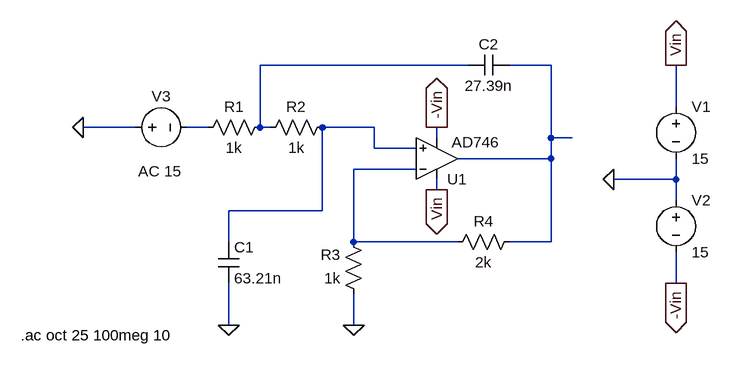
[diagram p0: schematic полосовой салена.asc]
полосовой салена.asc, the LTspice schematic file:
Version 4
SHEET 1 880 680
WIRE 256 64 -64 64
WIRE 384 64 320 64
WIRE 576 128 576 64
WIRE -256 160 -336 160
WIRE -144 160 -176 160
WIRE -64 160 -64 64
WIRE -48 160 -64 160
WIRE 112 160 32 160
WIRE 208 176 208 160
WIRE 384 176 384 64
WIRE 416 176 384 176
WIRE 112 192 112 160
WIRE 176 192 112 192
WIRE 384 208 384 176
WIRE 384 208 240 208
WIRE 176 224 80 224
WIRE 576 240 576 208
WIRE 576 240 480 240
WIRE 208 256 208 240
WIRE 576 272 576 240
WIRE 32 288 32 160
WIRE 32 288 -112 288
WIRE -112 336 -112 288
WIRE 80 336 80 224
WIRE 240 336 80 336
WIRE 384 336 384 208
WIRE 384 336 320 336
WIRE 576 400 576 352
WIRE -112 464 -112 400
WIRE 80 464 80 416
FLAG 480 240 0
FLAG 576 64 Vin
IOPIN 576 64 Out
FLAG 576 400 -Vin
IOPIN 576 400 Out
FLAG 208 256 Vin
IOPIN 208 256 Out
FLAG 208 160 -Vin
IOPIN 208 160 Out
FLAG -336 160 0
FLAG -112 464 0
FLAG 80 464 0
SYMBOL Opamps\\AD746 208 272 M180
WINDOW 3 23 89 Left 2
SYMATTR InstName U1
SYMBOL voltage 576 112 R0
SYMATTR InstName V1
SYMATTR Value 15
SYMBOL voltage 576 256 R0
SYMATTR InstName V2
SYMATTR Value 15
SYMBOL voltage -272 160 R270
WINDOW 0 32 56 VTop 2
WINDOW 3 -144 56 VBottom 2
WINDOW 123 -52 54 VBottom 2
WINDOW 39 0 0 Left 0
SYMATTR InstName V3
SYMATTR Value ""
SYMATTR Value2 AC 15
SYMBOL cap 320 48 R90
WINDOW 0 0 32 VBottom 2
WINDOW 3 32 32 VTop 2
SYMATTR InstName C2
SYMATTR Value 27.39n
SYMBOL res -48 144 R90
WINDOW 0 0 56 VBottom 2
WINDOW 3 32 56 VTop 2
SYMATTR InstName R1
SYMATTR Value 1k
SYMBOL res 48 144 R90
WINDOW 0 0 56 VBottom 2
WINDOW 3 32 56 VTop 2
SYMATTR InstName R2
SYMATTR Value 1k
SYMBOL res 96 432 R180
WINDOW 0 36 76 Left 2
WINDOW 3 36 40 Left 2
SYMATTR InstName R3
SYMATTR Value 1k
SYMBOL res 224 352 R270
WINDOW 0 32 56 VTop 2
WINDOW 3 0 56 VBottom 2
SYMATTR InstName R4
SYMATTR Value 2k
SYMBOL cap -128 336 R0
SYMATTR InstName C1
SYMATTR Value 63.21n
TEXT -432 480 Left 2 !.ac oct 25 100meg 10

The netlist it stands for:
* полосовой салена.asc
XU1 N004 N005 Vin -Vin N002 AD746  ; pins In+ In- V+ V- OUT
V1 Vin 0 15
V2 0 -Vin 15
V3 0 N003 AC 15
C2 N002 N001 27.39n
R1 N001 N003 1k
R2 N004 N001 1k
R3 0 N005 1k
R4 N005 N002 2k
C1 N004 0 63.21n
.ac oct 25 100meg 10
.backanno
.end